# Altium project IC555_PWM.PrjPcb
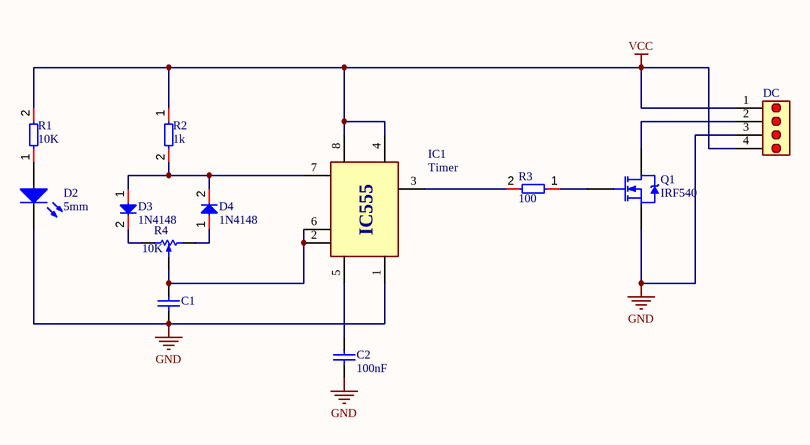
[diagram p0: Sheet2.SchDoc]
1 sheet, 12 parts. Net scope: global (net labels, ports and power ports of the same name join across sheets).
Board files: PCB6.PcbDoc, PCB7.PcbDoc

## Sheet Sheet2.SchDoc
size A

### Parts
C1  SMD 0603  [SMD CAPACITOR0805]  (value not drawn)
C2  100nF  [CN5]
D2  5mm  [LED 5mm BLUE]
D3  1N4148  [SOD-80]
D4  1N4148  [SOD-80]
DC  Header 4  [HEADER 4]  (value not drawn)
IC1  Timer  [DIP8]
Q1  IRF540  [TO220A]
R1  10K  [RES-0.25W-H-MF]
R2  1k  [RES-0.25W-H-MF]
R3  100  [RES-0.25W-H-MF]
R4  10K  [VOLUME2]

### Nets
GND: C1.1 C2.1 D2.2(K) DC.3 IC1.1 Q1.3(S)
VCC: DC.1 DC.4 IC1.4 IC1.8 R1.2 R2.1
NetC1_2: C1.2 IC1.2 IC1.6 R4.2(W)
NetC2_2: C2.2 IC1.5
NetD2_1: D2.1(A) R1.1
NetD3_1: D3.1 D4.2 IC1.7 R2.2
NetD3_2: D3.2 R4.3(-)
NetD4_1: D4.1 R4.1(+)
NetDC_2: DC.2 Q1.2(D)
NetIC1_3: IC1.3 R3.2
NetQ1_1: Q1.1(G) R3.1

### Notes on the sheet
- (in symbol 555) IC555

### Library data of the parts
C1 = CAP SMD
C2 = CN 33pF: Published: 8-Jun-2000; LatestRevisionDate: 17-Jul-2002; LatestRevisionNote: Re-released for DXP Platform.; PackageReference: RAD-0.3; Publisher: Altium Limited; PackageDescription: Radial Cap, Thru-Hole; 2 Leads; 0.3 in Pin Spacing
D2 = LED 5mm
D3 D4 = Diode 1N4148
IC1 = 555
R1-R3 = Resistors THD
R4 = Res Variable